# Altium schematic sheet Potentiostat.SchDoc
size A2; SheetNumber: 1; SheetTotal: 1
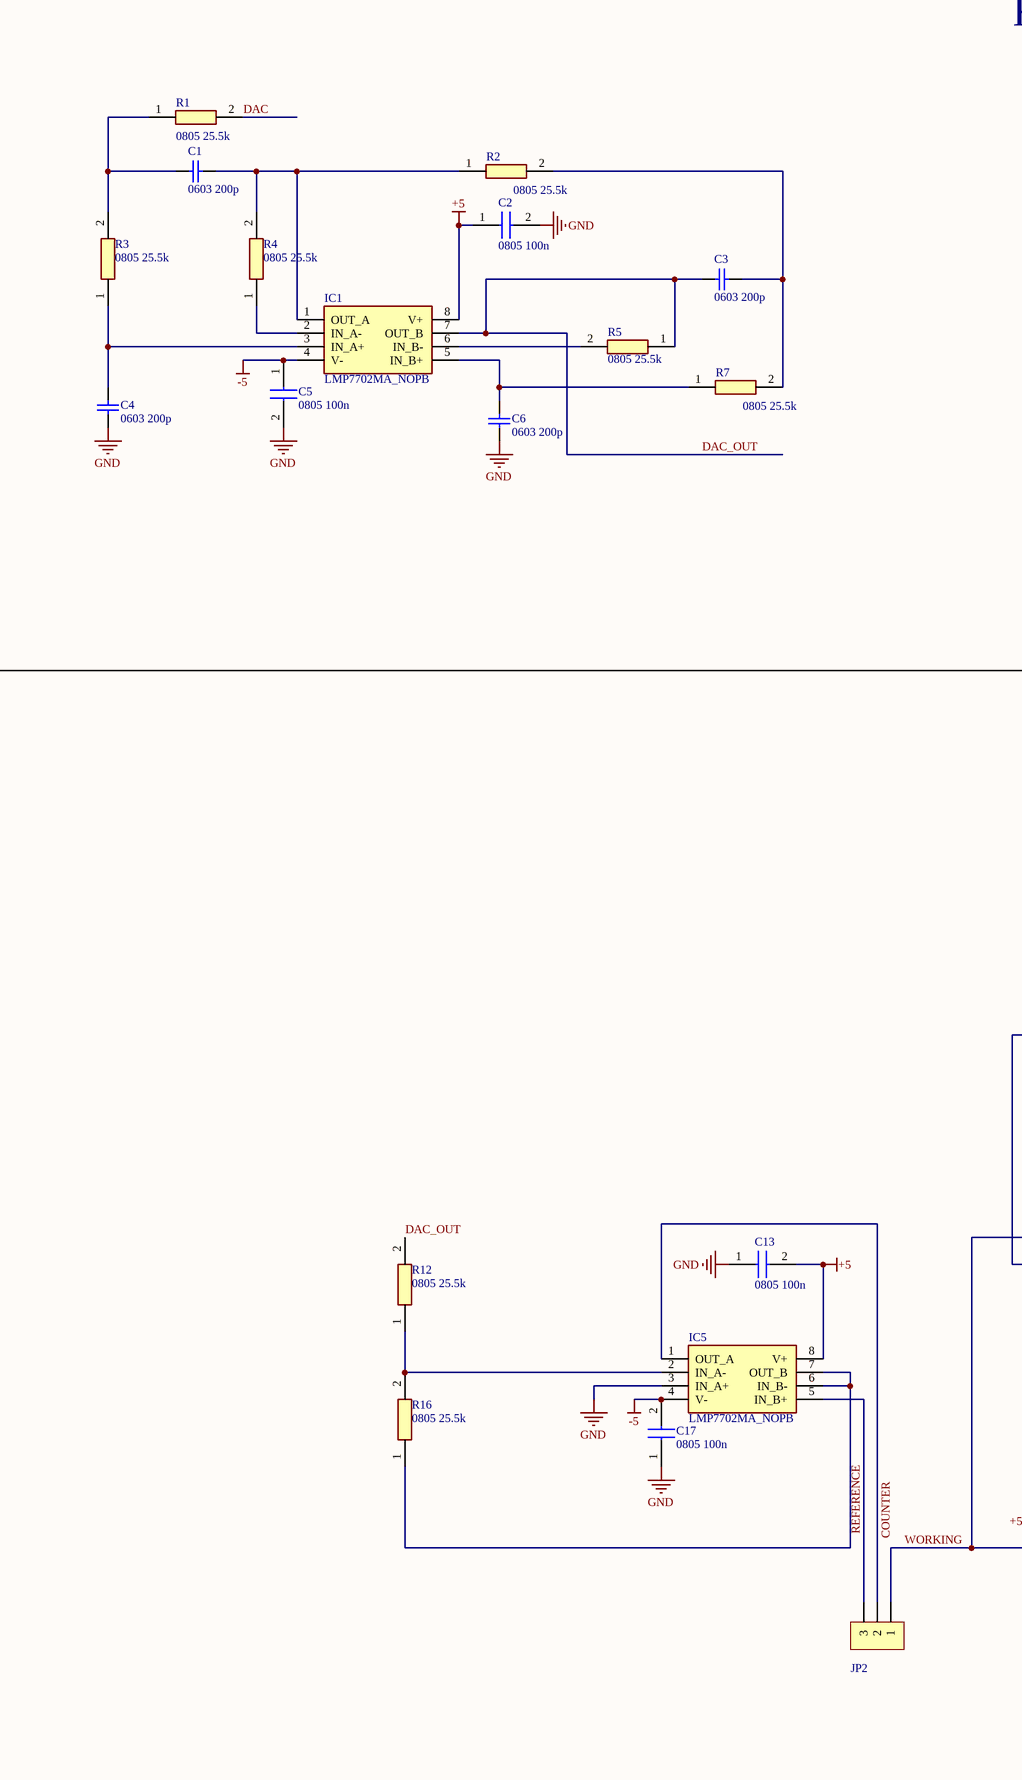
[diagram p0: Potentiostat.SchDoc, left]
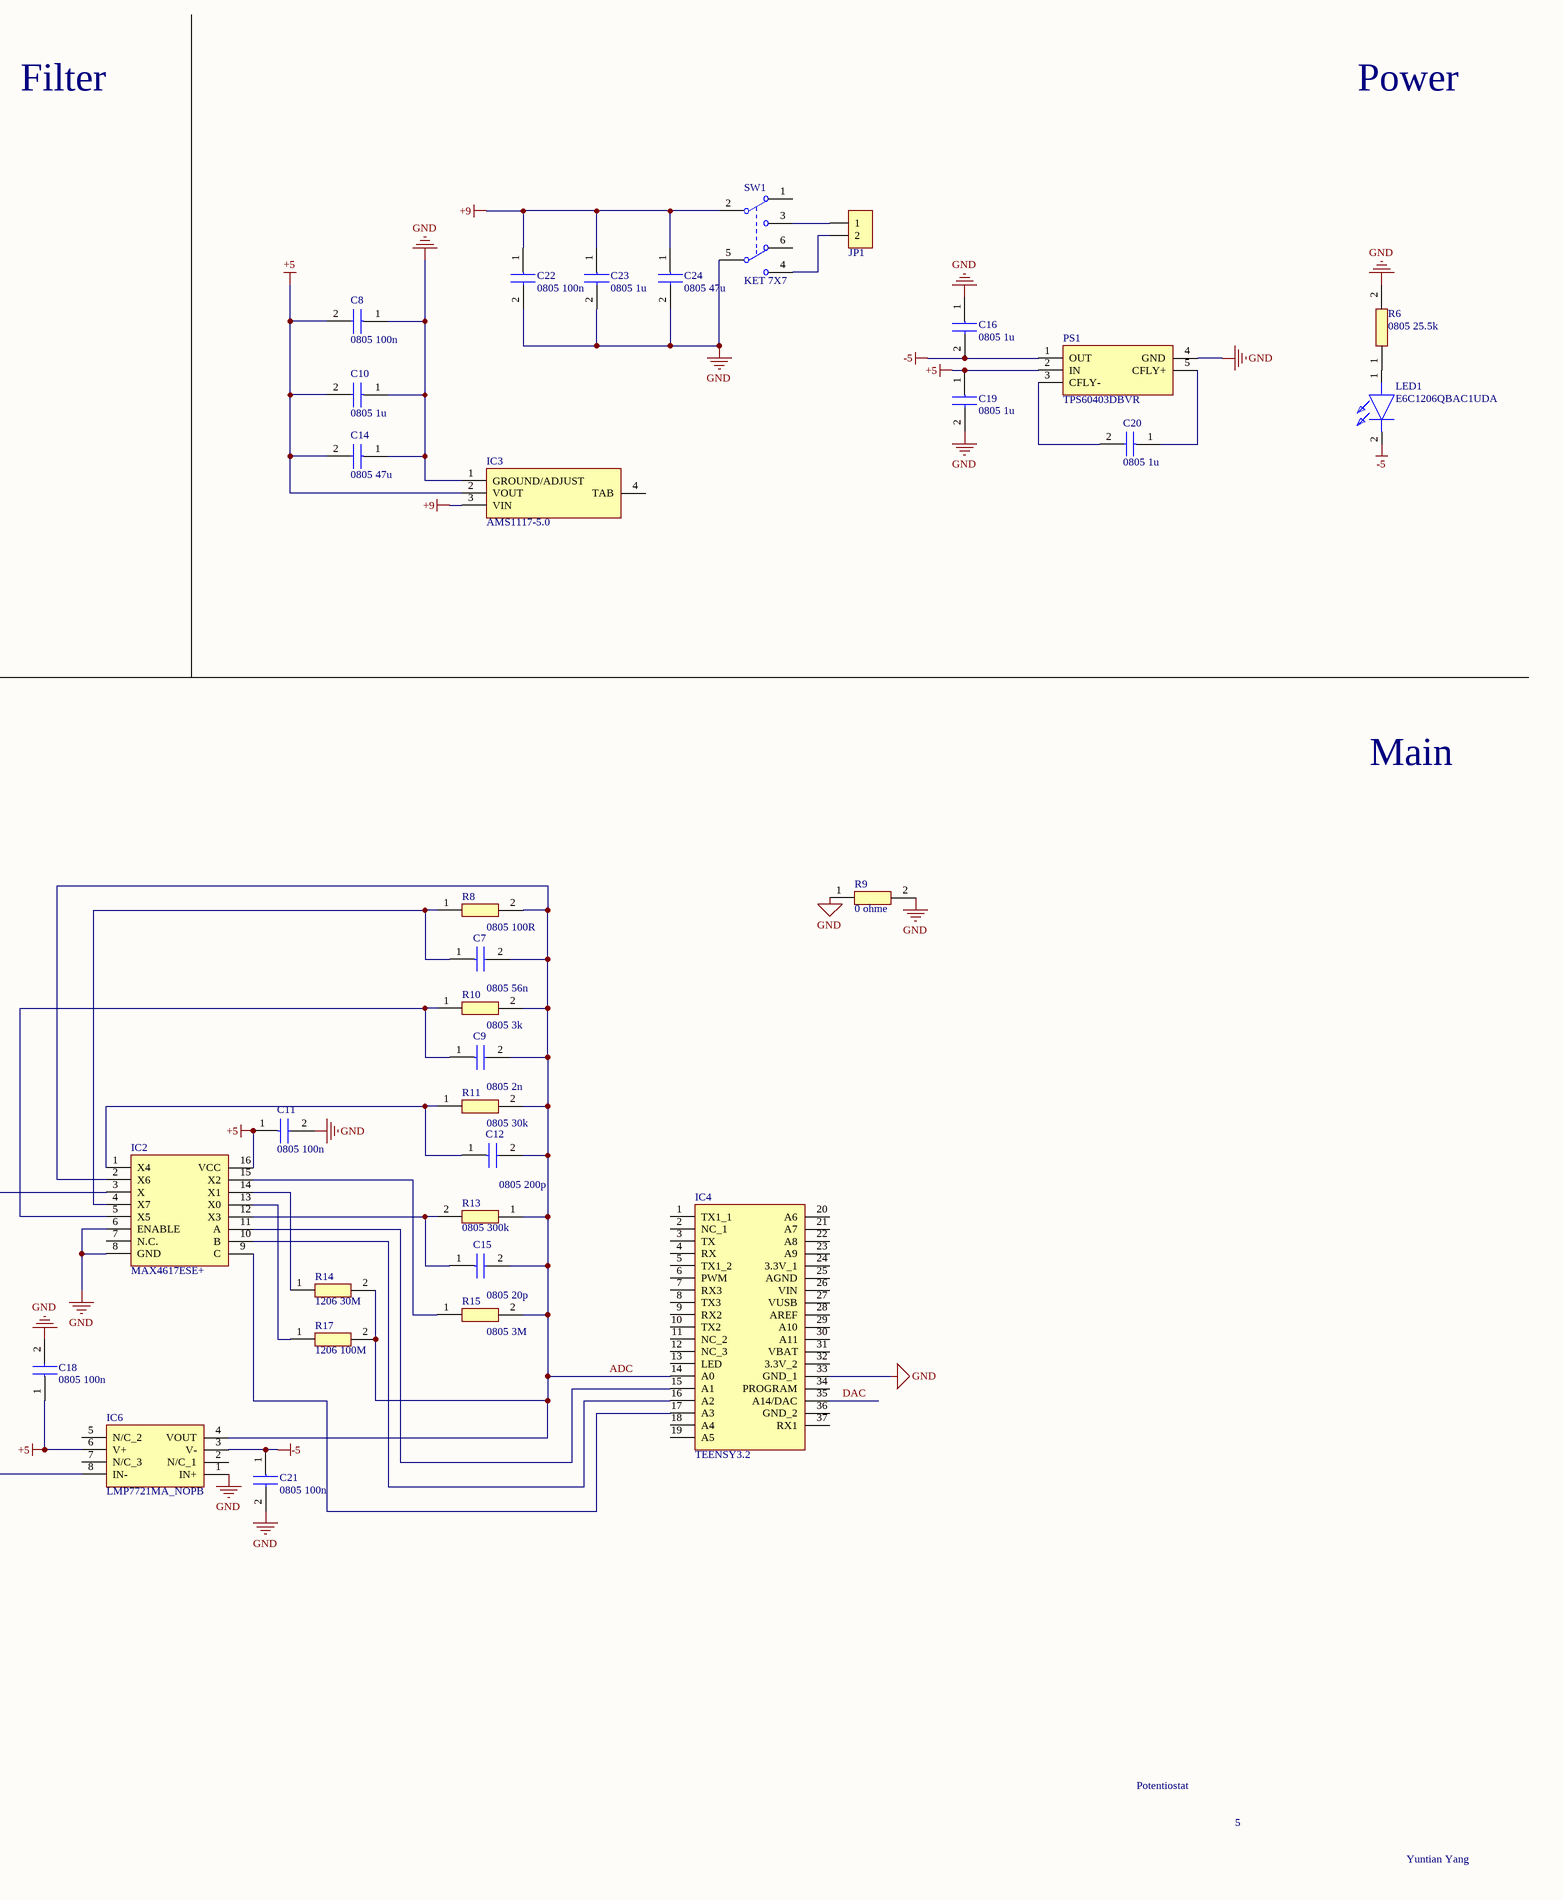
[diagram p1: Potentiostat.SchDoc, right]

## Parts
C1  0603 200p  [1608[0603]]
C2  0805 100n  [CAPC2012X130N]
C3  0603 200p  [1608[0603]]
C4  0603 200p  [1608[0603]]
C5  0805 100n  [CAPC2012X130N]
C6  0603 200p  [1608[0603]]
C7  0805 56n  [CAPC2012X130N]
C8  0805 100n  [CAPC2012X130N]
C9  0805 2n  [CAPC2012X130N]
C10  0805 1u  [CAPC2012X130N]
C11  0805 100n  [CAPC2012X130N]
C12  0805 200p  [CAPC2012X130N]
C13  0805 100n  [CAPC2012X130N]
C14  0805 47u  [CAPC2012X130N]
C15  0805 20p  [CAPC2012X130N]
C16  0805 1u  [CAPC2012X130N]
C17  0805 100n  [CAPC2012X130N]
C18  0805 100n  [CAPC2012X130N]
C19  0805 1u  [CAPC2012X130N]
C20  0805 1u  [CAPC2012X130N]
C21  0805 100n  [CAPC2012X130N]
C22  0805 100n  [CAPC2012X130N]
C23  0805 1u  [CAPC2012X130N]
C24  0805 47u  [CAPC2012X130N]
IC1  LMP7702MA_NOPB  [SOIC127P600X175-8N]
IC2  MAX4617ESE+  [SOIC127P600X175-16N]
IC3  AMS1117-5.0  [SOT229P700X180-4N]
IC4  TEENSY3.2  [TEENSY32]
IC5  LMP7702MA_NOPB  [SOIC127P600X175-8N]
IC6  LMP7721MA_NOPB  [SOIC127P600X175-8N]
JP1  HDR-1X2  [KF2EDGK5.08-LI-2P]  (value not drawn)
JP2  HDR-1X3  [KF128-5.08-3P]  (value not drawn)
LED1  E6C1206QBAC1UDA  [E6C1206QBAC1UDA]
PS1  TPS60403DBVR  [SOT95P280X145-5N]
R1  0805 25.5k  [RESC2012X65N]
R2  0805 25.5k  [RESC2012X65N]
R3  0805 25.5k  [RESC2012X65N]
R4  0805 25.5k  [RESC2012X65N]
R5  0805 25.5k  [RESC2012X65N]
R6  0805 25.5k  [RESC2012X65N]
R7  0805 25.5k  [RESC2012X65N]
R8  0805 100R  [RESC2012X65N]
R9  0 ohme  [RESC6331X75N]
R10  0805 3k  [RESC2012X65N]
R11  0805 30k  [RESC2012X65N]
R12  0805 25.5k  [RESC2012X65N]
R13  0805 300k  [RESC2012X65N]
R14  1206 30M  [RESC3216X75N]
R15  0805 3M  [RESC2012X65N]
R16  0805 25.5k  [RESC2012X65N]
R17  1206 100M  [RESC3216X75N]
SW1  KET 7X7  [KFT DIP-7X7]

## Nets
+5: C2.1 C8.2 C10.2 C11.1 C13.2 C14.2 C18.1 C19.1 IC1.8(V+) IC2.16(VCC) IC3.2(VOUT) IC5.8(V+) IC6.6(V+) PS1.2(IN)
+9: C22.1 C23.1 C24.1 IC3.3(VIN) SW1.2(COM2)
-5: C5.1 C16.2 C17.2 C21.1 IC1.4(V-) IC5.4(V-) IC6.3(V-) LED1.2(K) PS1.1(OUT)
GND: C2.2 C4.1 C5.2 C6.1 C8.1 C10.1 C11.2 C13.1 C14.1 C16.1 C17.1 C18.2 C19.2 C21.2 C22.2 C23.2 C24.2 IC2.6(ENABLE) IC2.8(GND) IC3.1(GROUND/ADJUST) IC4.33(GND_1) IC5.3(IN_A+) IC6.1(IN+) PS1.4(GND) R6.2 R9.1 R9.2 SW1.5(COM2)
ADC: C7.2 C9.2 C12.2 C15.2 IC2.2(X6) IC4.14(A0) IC6.4(VOUT) R8.2 R10.2 R11.2 R13.1 R14.2 R15.2 R17.2
COUNTER: IC5.1(OUT_A) JP2.2
DAC: IC4.35(A14/DAC) R1.2
DAC_OUT: C3.1 IC1.7(OUT_B) R5.1 R12.2
REFERENCE: IC5.5(IN_B+) JP2.3
WORKING: IC2.3(X) IC6.8(IN-) JP2.1
NetC1_1: C1.1 R1.1 R3.2
NetC1_2: C1.2 IC1.1(OUT_A) R2.1 R4.2
NetC3_2: C3.2 R2.2 R7.2
NetC4_2: C4.2 IC1.3(IN_A+) R3.1
NetC6_2: C6.2 IC1.5(IN_B+) R7.1
NetC7_1: C7.1 IC2.4(X7) R8.1
NetC9_1: C9.1 IC2.5(X5) R10.1
NetC12_1: C12.1 IC2.1(X4) R11.1
NetC15_1: C15.1 IC2.12(X3) R13.2
NetC20_1: C20.1 PS1.5(CFLY+)
NetC20_2: C20.2 PS1.3(CFLY-)
NetIC1_2: IC1.2(IN_A-) R4.1
NetIC1_6: IC1.6(IN_B-) R5.2
NetIC2_9: IC2.9(C) IC4.17(A3)
NetIC2_10: IC2.10(B) IC4.16(A2)
NetIC2_11: IC2.11(A) IC4.15(A1)
NetIC2_13: IC2.13(X0) R17.1
NetIC2_14: IC2.14(X1) R14.1
NetIC2_15: IC2.15(X2) R15.1
NetIC5_2: IC5.2(IN_A-) R12.1 R16.2
NetIC5_6: IC5.6(IN_B-) IC5.7(OUT_B) R16.1
NetJP1_1: JP1.1 SW1.3(NO1)
NetJP1_2: JP1.2 SW1.4(NO2)
NetLED1_1: LED1.1(A) R6.1

Not connected (* = marked no-connect by the designer): IC2 7(N.C.); IC3 4(TAB); IC4 1(TX1_1) 2(NC_1) 3(TX) 4(RX) 5(TX1_2) 6(PWM) 7(RX3) 8(TX3) 9(RX2) 10(TX2) 11(NC_2) 12(NC_3) 13(LED) 18(A4) 19(A5) 20(A6) 21(A7) 22(A8) 23(A9) 24(3.3V_1) 25(AGND) 26(VIN) 27(VUSB) 28(AREF) 29(A10) 30(A11) 31(VBAT) 32(3.3V_2) 34(PROGRAM) 36(GND_2) 37(RX1); IC6 2(N/C_1) 5(N/C_2) 7(N/C_3); SW1 1(NC1) 6(NC2)

## Notes on the sheet
- Filter
- Power
- Main
- Potentiostat
- 5
- Yuntian Yang

## Library data of the parts
C1 C3 C4 C6 = Cap Semi: Capacitor (Semiconductor SIM Model); Published: 8-Jun-2000; LatestRevisionDate: 29-May-2009; LatestRevisionNote: IPC-7351 Footprint Added.; PackageReference: C1206; Publisher: Altium Limited; PackageDescription: Chip Capacitor
C2 C5 C7-C24 = C3216X5R1C106K085AC: Capacitor; Manufacturer_Name: TDK; Height: 1mm; Manufacturer_Part_Number: C3216X5R1C106K085AC; Mouser Part Number: 810-C3216X5R1C106K0C; Mouser Price/Stock: https://www.mouser.com/Search/Refine.aspx?Keyword=810-C3216X5R1C106K0C
IC1 IC5 = LMP7702MA_NOPB: Integrated Circuit; Manufacturer_Name: Texas Instruments; Manufacturer_Part_Number: LMP7702MA/NOPB; Datasheet Link: http://www.ti.com/lit/ds/symlink/lmp7702.pdf; Height: 1.75mm; Mouser Part Number: 926-LMP7702MA/NOPB; Mouser Price/Stock: https://www.mouser.co.uk/ProductDetail/Texas-Instruments/LMP7702MA-NOPB?qs=7lkVKPoqpba3BfR5yUfnkg%3D%3D; Arrow Part Number: LMP7702MA/NOPB; Arrow Price/Stock: https://www.arrow.com/en/products/lmp7702manopb/texas-instruments?region=nac
IC2 = MAX4617ESE+: Integrated Circuit; Manufacturer_Name: Maxim Integrated; Datasheet Link: https://pdfserv.maximintegrated.com/en/ds/MAX4617-MAX4619.pdf; Height: 1.75mm; Manufacturer_Part_Number: MAX4617ESE+; Mouser Part Number: 700-MAX4617ESE; Mouser Price/Stock: https://www.mouser.co.uk/ProductDetail/Maxim-Integrated/MAX4617ESE%2b?qs=1THa7WoU59Fm6MXUxXxCnA%3D%3D
IC3 = AMS1117-5.0: Integrated Circuit; Manufacturer_Name: Advanced Monolithic Systems; Datasheet Link: http://www.advanced-monolithic.com/pdf/ds1117.pdf; Height: 1.8mm; Manufacturer_Part_Number: AMS1117-5.0
IC4 = TEENSY3.2: Integrated Circuit; Manufacturer_Name: PJRC; Datasheet Link: https://www.pjrc.com/store/teensy32.html; Height: 4.07mm; Manufacturer_Part_Number: TEENSY3.2
IC6 = LMP7721MA_NOPB: Integrated Circuit; Manufacturer_Name: Texas Instruments; Manufacturer_Part_Number: LMP7721MA/NOPB; Datasheet Link: http://www.ti.com/lit/ds/symlink/lmp7721.pdf; Height: 1.75mm; Mouser Part Number: 926-LMP7721MA/NOPB; Mouser Price/Stock: https://www.mouser.co.uk/ProductDetail/Texas-Instruments/LMP7721MA-NOPB?qs=7lkVKPoqpbayTMxXZQmMRA%3D%3D; Arrow Part Number: LMP7721MA/NOPB; Arrow Price/Stock: https://www.arrow.com/en/products/lmp7721manopb/texas-instruments?region=nac
JP1 = Header 2: 2P接插件; 联系卖家，免费技术支持: 唯一出售店铺网址https://shop463601444.taobao.com; BOM名称: 2P接插件
JP2 = Header 3: 3P接插件; 联系卖家，免费技术支持: 唯一出售店铺网址https://shop463601444.taobao.com; BOM名称: 3P接插件
LED1 = E6C1206QBAC1UDA: LED; Manufacturer_Name: EKINGLUX; Datasheet Link: https://datasheet.lcsc.com/szlcsc/1910111742_EKINGLUX-E6C1206QBAC1UDA_C375460.pdf; Height: 1.1mm; Manufacturer_Part_Number: E6C1206QBAC1UDA
PS1 = TPS60403DBVR: Power Supply; Manufacturer_Name: Texas Instruments; Datasheet Link: http://www.ti.com/lit/gpn/tps60403; Height: 1.45mm; Manufacturer_Part_Number: TPS60403DBVR; Mouser Part Number: 595-TPS60403DBVR; Mouser Price/Stock: https://www.mouser.co.uk/ProductDetail/Texas-Instruments/TPS60403DBVR?qs=Gse6rAGbi78QziU1WFApxQ%3D%3D; Arrow Part Number: TPS60403DBVR; Arrow Price/Stock: https://www.arrow.com/en/products/tps60403dbvr/texas-instruments?region=nac
R1-R8 R10-R13 R15 R16 = PCF0805R-3K24BT1: Resistor; Manufacturer_Name: WELWYN; Height: 0.65mm; Manufacturer_Part_Number: PCF0805R-3K24BT1; Mouser Part Number: 756-PCF0805R3K24BT1; Mouser Price/Stock: https://www.mouser.com/Search/Refine.aspx?Keyword=756-PCF0805R3K24BT1
R9 = CR2512-F_-1R00ELF: Resistor; Manufacturer_Name: Bourns; Manufacturer_Part_Number: CR2512-F/-1R00ELF; Height: 0.75mm; Mouser Part Number: 652-CR2512-F/1R00ELF; Mouser Price/Stock: https://www.mouser.co.uk/ProductDetail/Bourns/CR2512-F-1R00ELF?qs=W%2FMpXkg%252BdQ6b1PcPiGLK9Q%3D%3D
R14 R17 = CR1206-F_-2R00ELF: Resistor; Manufacturer_Name: Bourns; Manufacturer_Part_Number: CR1206-F/-2R00ELF; Height: 0.75mm; Mouser Part Number: 652-CR1206-F/2R00ELF; Mouser Price/Stock: https://www.mouser.co.uk/ProductDetail/Bourns/CR1206-F-2R00ELF?qs=W%2FMpXkg%252BdQ47Z%2FeZv1nDSg%3D%3D
SW1 = KET 7X7: 7*7自锁开关; 联系卖家，免费查找封装: 唯一出售店铺网址https://shop463601444.taobao.com; BOM名称: 7*7自锁开关